# Altium project 传感器控制继电器模块.PRJPCB
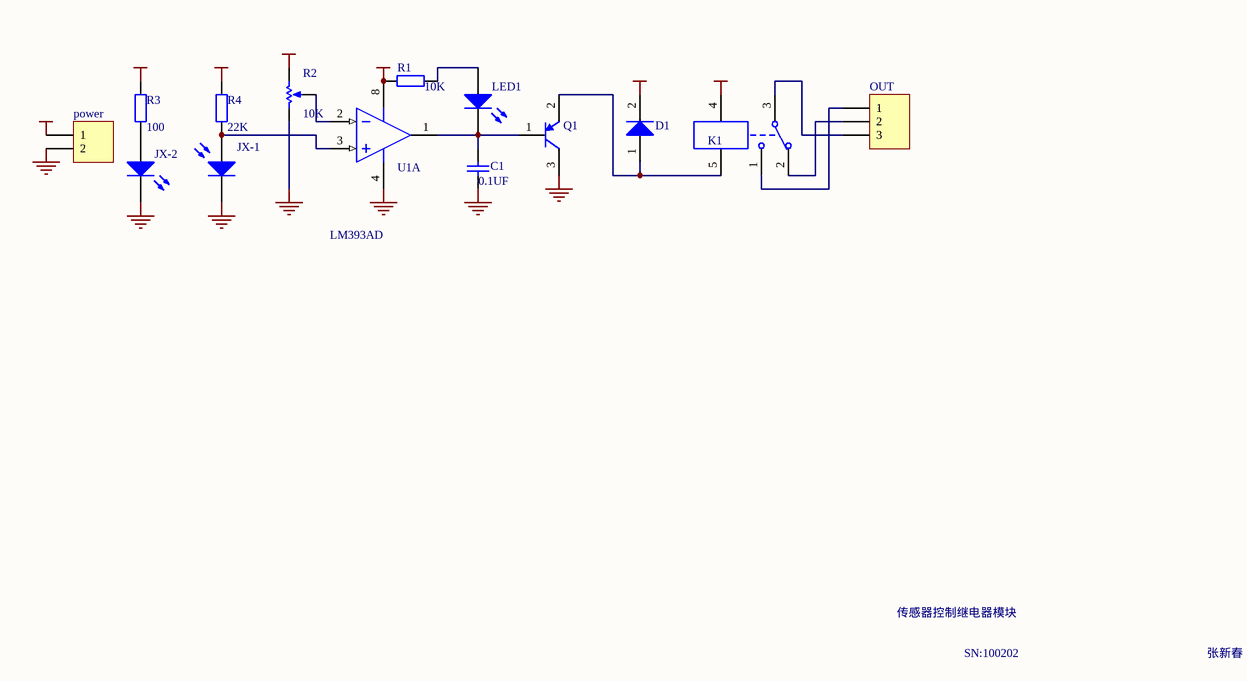
[diagram p0: 传感器控制继电器模块.SCHDOC]
1 sheet, 14 parts. Net scope: global (net labels, ports and power ports of the same name join across sheets).
Board file: 传感器控制继电器模块.PCBDOC

## Sheet 传感器控制继电器模块.SCHDOC
size A4

### Parts
C1  value 0.1UF  [HDR1X2]
D1  ZL2JG  [D-ZL-10]  (value not drawn)
JX-1  (no value)  [HDR1X2]
JX-2  (no value)  [HDR1X2]
K1  JDQYCK  [JQC-3F/T73]  (value not drawn)
LED1  (no value)  [HDR1X2]
OUT  PZ_3  [JK128_3]  (value not drawn)
power  PZ_2  [DYDZ]  (value not drawn)
Q1  TPSJG_PNP  [SO-G3]  (value not drawn)
R1  value 10K  [HDR1X2]
R2  value 10K  [SIP3-D]
R3  value 100  [HDR1X2]
R4  value 22K  [HDR1X2]
U1  LM393AD  [CDFP-8]  (part A of 2)

### Nets
GND: C1.1 JX-1.2(K) JX-2.2(K) power.2 Q1.3(C) R2.2(BOT) U1.4(V-)
VCC: D1.2(K) K1.4 power.1 R1.2 R2.1(TOP) R3.2 R4.2 U1.8(V+)
NetC1_2: C1.2 LED1.2(K) Q1.1(B) U1.1(OUT)
NetD1_1: D1.1(A) K1.5 Q1.2(E)
NetJX-1_1: JX-1.1(A) R4.1 U1.3(IN+)
NetJX-2_1: JX-2.1(A) R3.1
NetK1_1: K1.1 OUT.1
NetK1_2: K1.2 OUT.2
NetK1_3: K1.3 OUT.3
NetLED1_1: LED1.1(A) R1.1
NetR2_3: R2.3(TAP) U1.2(IN-)

### Notes on the sheet
- 传感器控制继电器模块
- SN:100202
- 张新春

### Library data of the parts
C1 = Cap Semi: Capacitor (Semiconductor SIM Model); Published: 8-Jun-2000; LatestRevisionDate: 17-Jul-2002; LatestRevisionNote: Re-released for DXP Platform.; PackageReference: C1206; Publisher: Altium Limited
D1 = ZL2JG: 整流二极管; Published: 8-Jun-2000; LatestRevisionDate: 17-Jul-2002; LatestRevisionNote: Re-released for DXP Platform.; DatasheetDocument: 1998; PackageDocument: Aug-1999; PackageReference: DO-201AD; Publisher: Altium Limited
JX-1 = Photo Sen: Photosensitive Diode; Published: 24-Mar-1999; LatestRevisionDate: 17-Jul-2002; LatestRevisionNote: Re-released for DXP Platform.; Publisher: Altium Limited
JX-2 LED1 = LED3: Typical BLUE SiC LED; Published: 8-Jun-2000; LatestRevisionDate: 17-Dec-2003; LatestRevisionNote: PCB Footprint replaced.; Publisher: Altium Limited
K1 = JDQYCK: 继电器——1常开1常闭; Published: 24-Mar-1999; LatestRevisionDate: 17-Jul-2002; LatestRevisionNote: Re-released for DXP Platform.; Publisher: Altium Limited
OUT = PZ_3: 排针——3; LatestRevisionDate: 17-Jul-2002; LatestRevisionNote: Re-released for DXP Platform.; Publisher: Altium Limited
power = PZ_2: 排针——2; LatestRevisionDate: 17-Jul-2002; LatestRevisionNote: Re-released for DXP Platform.; Publisher: Altium Limited
Q1 = TPSJG_PNP: 贴片三极管——PNP; Published: 8-Jun-2000; LatestRevisionDate: 15-Jan-2003; LatestRevisionNote: PCB Footprint 'BCY-W3/D4.7' replaced; DatasheetDocument: 1997; PackageReference: TO-92A; Publisher: Altium Limited; Code_JEDEC: TO-92A
R1 R3 R4 = Res2: Resistor; Published: 8-Jun-2000; LatestRevisionDate: 17-Jul-2002; LatestRevisionNote: Re-released for DXP Platform.; Publisher: Altium Limited
R2 = RPot: Potentiometer; Sim Note: Enter the Resistance value and the set point into parameter fields.; Set Position: 0.5; Published: 8-Jun-2000; LatestRevisionDate: 17-Jul-2002; LatestRevisionNote: Re-released for DXP Platform.; Publisher: Altium Limited
U1 = LM393AD: Low-Power Dual Voltage Comparator; Published: 24-Aug-2001; LatestRevisionDate: 6-Jun-2005; LatestRevisionNote: Stylized 3D Model Added.; DatasheetDocument: Nov-1992; PackageDocument: Jul-1998; PackageReference: SO8; Publisher: Altium Limited; Code_JEDEC: MS-012-AA; Code_IPC: SO8; ComponentLink1Description: Manufacturer Link; ComponentLink1URL: http://www.st.com/